# Altium project sig_gen_card.PrjPcb (part 4 of 4)
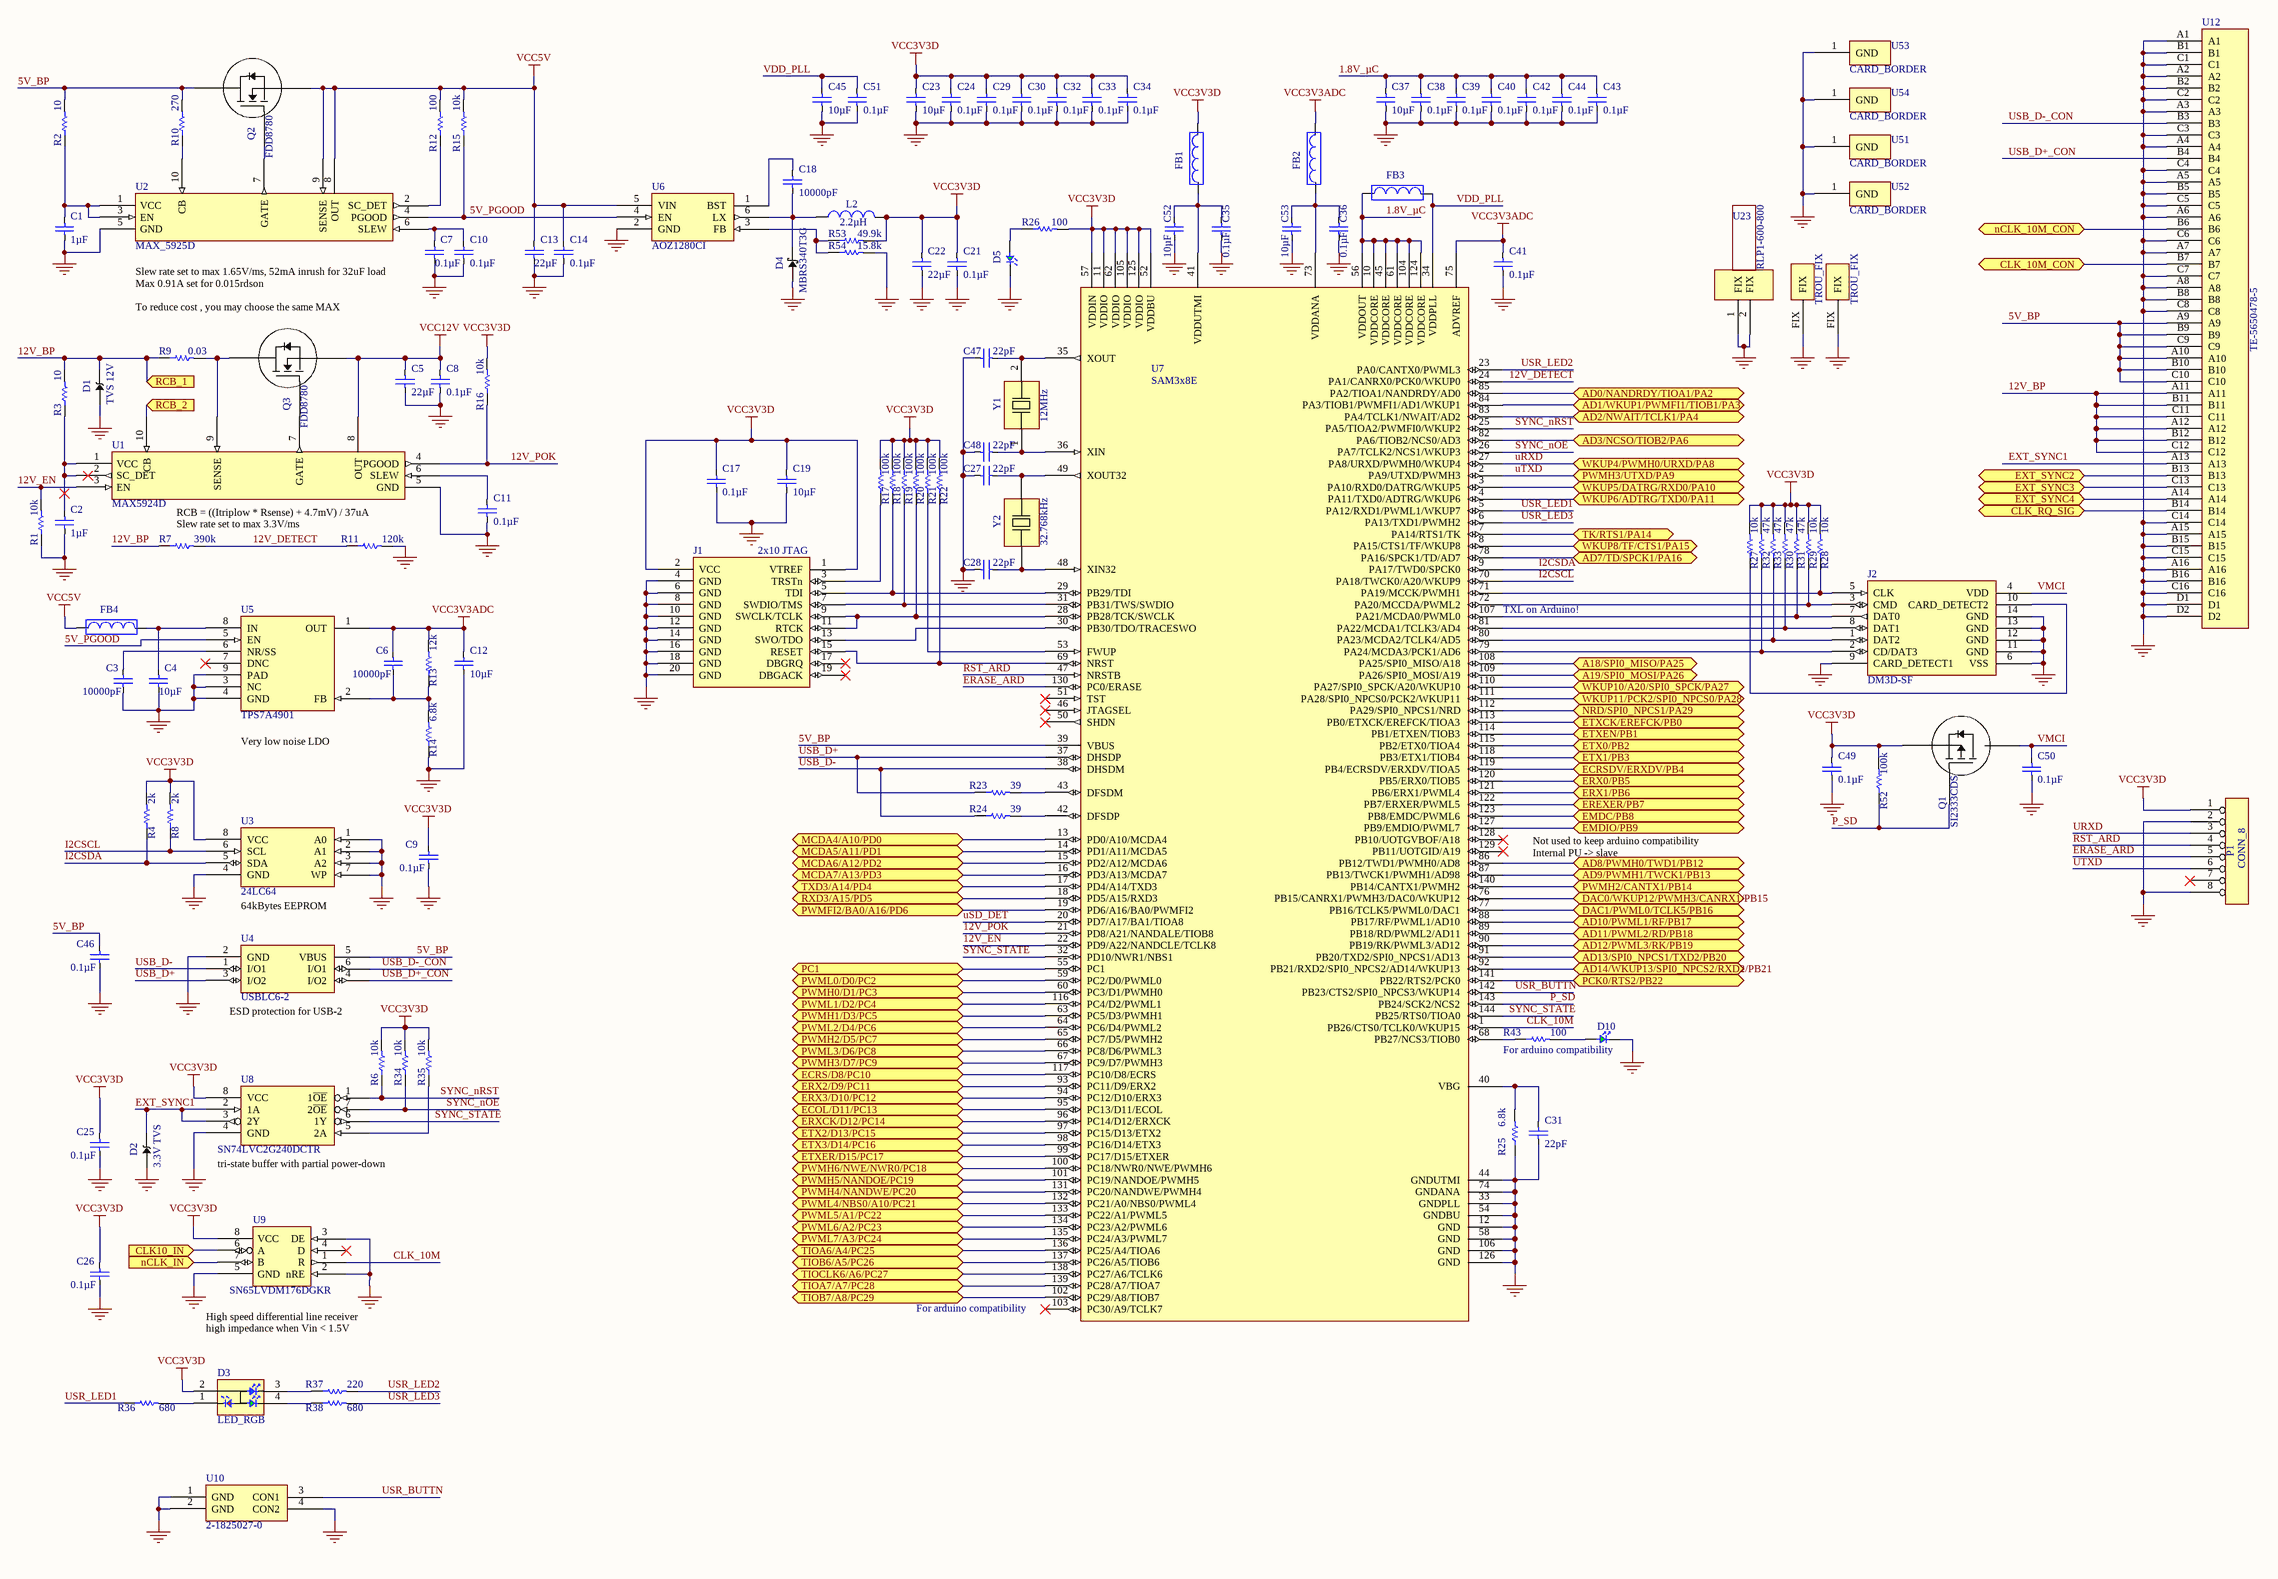
[diagram p7: EasyPHI_Core.SchDoc]

## Sheet EasyPHI_Core.SchDoc (continued)

### Library data of the parts (continued)
Y2 = ABS25-32.768KHZ-T: CRYSTAL 32.7680KHZ 12.5PF SMD; Manufacturer: Abracon LLC; Frequency Tolerance: ±20ppm; ESR (Equivalent Series Resistance): 50 kOhm; Operating Mode: Fundamental; Design Item Id: ABS25-32.768KHZ-T; Supplier 1: Digi-Key; Supplier Part Number 1: 535-9166-1-ND; Manufacturer Part Number: ABS25-32.768KHZ-T; RoHS: RoHS Compliant; Category: Crystals and Oscillators; Stock 1: 847492; Pricing 1: 1=0.38, 10=0.316, 50=0.2832, 100=0.252, 500=0.24, 1000=0.2016 (USD); Packaging: Cut Tape (CT); Type: kHz Crystal (Tuning Fork); Operating Temperature: -40°C ~ 85°C; Mounting Type: Surface Mount; Package / Case: 4-SOJ, 5.50mm pitch; ComponentLink1URL: http://www.abracon.com/Resonators/abs25.pdf; ComponentLink1Description: http://www.abracon.com/Resonators/abs25.pdf; Frequency Stability: -; Load Capacitance: 12.5pF; Ratings: -; Size / Dimension: 0.315" L x 0.150" W (8.00mm x 3.80mm); Height: 0.098" (2.50mm)

## Sheet Divider.SchDoc
size B; Organization: Mechanart, LLC; Address1: 397 Laurie Meadows Drive; Address2: Apt. 437; Address3: San Mateo, CA 94403
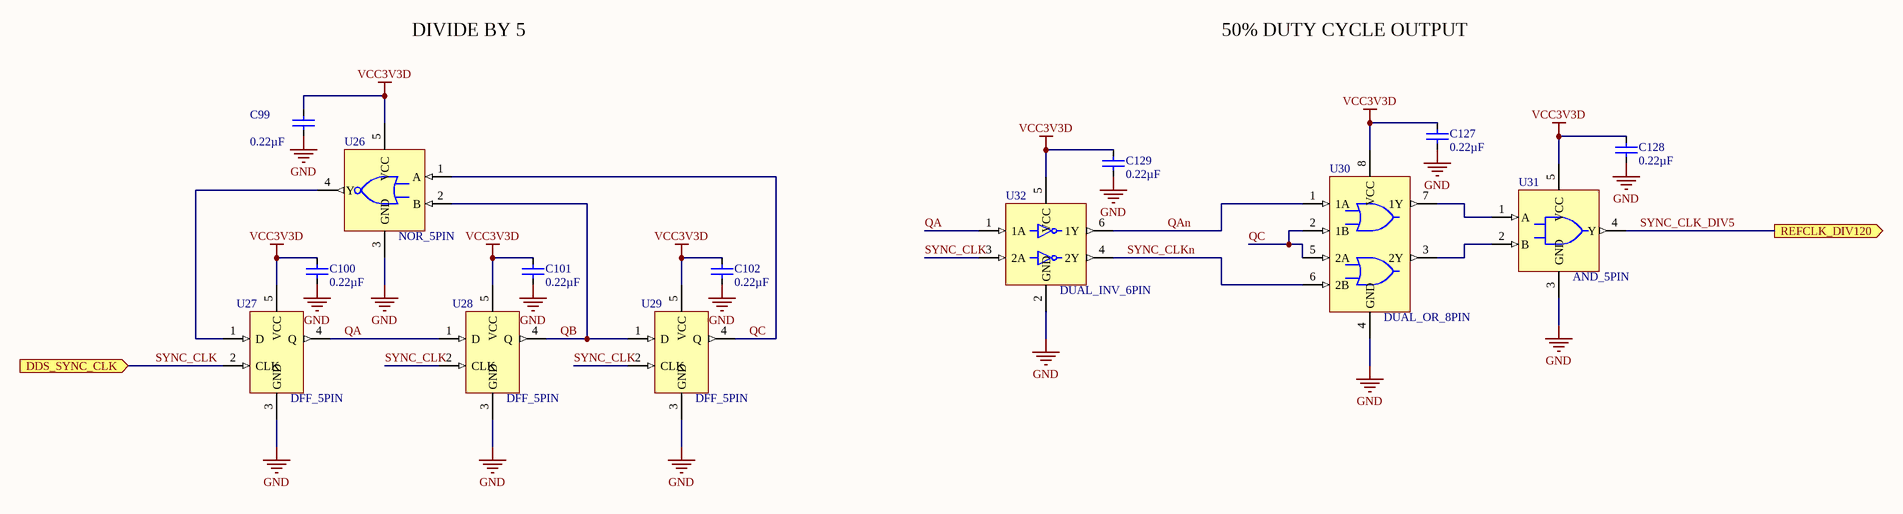
[diagram p5: Divider.SchDoc]

### Parts
(Parts that share a designator on the sheet are numbered #1, #2 ... from top to bottom, then left to right.)
C99#2  0.22µF  [CAPC1005X50L25N]
C100#2  0.22µF  [CAPC1005X50L25N]
C101#2  0.22µF  [CAPC1005X50L25N]
C102#2  0.22µF  [CAPC1005X50L25N]
C127  0.22µF  [CAPC1005X50L25N]
C128  0.22µF  [CAPC1005X50L25N]
C129  0.22µF  [CAPC1005X50L25N]
U26#2  NOR_5PIN  [SOT65P210X90-5L20N]
U27  DFF_5PIN  [SOT65P210X90-5L20N]
U28  DFF_5PIN  [SOT65P210X90-5L20N]
U29  DFF_5PIN  [SOT65P210X90-5L20N]
U30  DUAL_OR_8PIN  [SOP50P310X90-8L15N]
U31  AND_5PIN  [SOT65P210X90-5L20N]
U32  DUAL_INV_6PIN  [SOT65P210X110-6L20N]

### Ports
DDS_SYNC_CLK (in), REFCLK_DIV120 (out)

### Nets
GND: C99#2.2 C100#2.2 C101#2.2 C102#2.2 C127.2 C128.2 C129.2 U26#2.3(GND) U27.3(GND) U28.3(GND) U29.3(GND) U30.4(GND) U31.3(GND) U32.2(GND)
VCC3V3D: C99#2.1 C100#2.1 C101#2.1 C102#2.1 C127.1 C128.1 C129.1 U26#2.5(VCC) U27.5(VCC) U28.5(VCC) U29.5(VCC) U30.8(VCC) U31.5(VCC) U32.5(VCC)
QA: U27.4(Q) U28.1(D) U32.1(1A)
QAn: U30.1(1A) U32.6(1Y)
QB: U26#2.2(B) U28.4(Q) U29.1(D)
QC: U26#2.1(A) U29.4(Q) U30.2(1B) U30.5(2A)
SYNC_CLK: U27.2(CLK) U28.2(CLK) U29.2(CLK) U32.3(2A) ; port DDS_SYNC_CLK  [project net DDS_SYNC_CLK]
SYNC_CLK_DIV5: U31.4(Y) ; port REFCLK_DIV120  [project net REFCLK_DIV120]
SYNC_CLKn: U30.6(2B) U32.4(2Y)
NetU26#2_4: U26#2.4(Y) U27.1(D)
NetU30_3: U30.3(2Y) U31.2(B)
NetU30_7: U30.7(1Y) U31.1(A)

### Notes on the sheet
- DIVIDE BY 5
- 50% DUTY CYCLE OUTPUT
- Title
- Size:
- Date:
- B
- Number:
- Time:
- Revision:
- Sheet
- of
- File:

### Library data of the parts
C99#2 C100#2 C101#2 C102#2 C127-C129 = GRT155R6YA224KE01D: CAP CER 0.22UF 35V 10% X5R 0402; Manufacturer: Murata Electronics North America; Design Item Id: GRT155R6YA224KE01D; Supplier 1: Digi-Key; Supplier Part Number 1: 490-12271-1-ND; Manufacturer Part Number: GRT155R6YA224KE01D; RoHS: RoHS Compliant; Category: Capacitors; Stock 1: 8428; Pricing 1: 1=0.1, 10=0.054, 50=0.0292, 100=0.0248, 250=0.02024, 500=0.01732, 1000=0.0135, 5000=0.01125 (USD); Packaging: Cut Tape (CT); Applications: Automotive; Operating Temperature: -55°C ~ 85°C; Mounting Type: Surface Mount, MLCC; Package / Case: 0402 (1005 Metric); ComponentLink1URL: http://search.murata.co.jp/Ceramy/image/img/A01X/G101/ENG/GRT155R6YA224KE01-01.pdf; ComponentLink1Description: http://search.murata.co.jp/Ceramy/image/img/A01X/G101/ENG/GRT155R6YA224KE01-01.pdf; Capacitance: 0.22µF; Tolerance: ±10%; Voltage - Rated: 35V; Temperature Coefficient: X5R; Ratings: AEC-Q200; Size / Dimension: 0.039" L x 0.020" W (1.00mm x 0.50mm); Height - Seated (Max): -; Thickness (Max): 0.022" (0.55mm); Lead Spacing: -; Features: Derating Recommended; Lead Style: -
U26#2 = SN74AUP1T02DCKR: IC GATE NOR 1CH 2-INP SC-70-5; Manufacturer: Texas Instruments; Logic Type: NOR Gate; Current - Output High, Low: 4mA, 4mA; Max Propagation Delay @ V, Max CL: 4.4ns @ 3.3V, 30pF; Voltage - Supply: 2.3 V ~ 3.6 V; Number of Circuits: 1; Number of Inputs: 2; Current - Quiescent (Max): 0.5µA; Logic Level - Low: 0.35 V ~ 0.5 V; Logic Level - High: 1.1 V ~ 1.19 V; Design Item Id: SN74AUP1T02DCKR; Supplier 1: Digi-Key; Supplier Part Number 1: 296-27389-1-ND; Manufacturer Part Number: SN74AUP1T02DCKR; RoHS: RoHS Compliant; Category: Integrated Circuits (ICs); Stock 1: 6420; Pricing 1: 1=0.36, 10=0.29, 100=0.198, 500=0.1482, 1000=0.111 (USD); Packaging: Cut Tape (CT); Operating Temperature: -40°C ~ 85°C; Mounting Type: Surface Mount; Package / Case: 5-TSSOP, SC-70-5, SOT-353; Supplier Device Package: SC-70-5; ComponentLink1URL: http://www.ti.com/lit/ds/symlink/sn74aup1t02.pdf; ComponentLink1Description: http://www.ti.com/lit/ds/symlink/sn74aup1t02.pdf; Features: Schmitt Trigger
U27-U29 = SN74AUP1G79DCKR: IC D-TYPE POS TRG SNGL SC70-5; Manufacturer: Texas Instruments; Number of Elements: 1; Current - Output High, Low: 4mA, 4mA; Function: Standard; Output Type: Non-Inverted; Frequency - Clock: 266MHz; Max Propagation Delay @ V, Max CL: 5.8ns @ 3.3V, 30pF; Trigger Type: Positive Edge; Voltage - Supply: 0.8 V ~ 3.6 V; Current - Quiescent: 0.5µA; Input Capacitance: 1.5pF; Design Item Id: SN74AUP1G79DCKR; Supplier 1: Digi-Key; Supplier Part Number 1: 296-17660-1-ND; Manufacturer Part Number: SN74AUP1G79DCKR; RoHS: RoHS Compliant; Category: Integrated Circuits (ICs); Stock 1: 8359; Pricing 1: 1=0.48, 10=0.365, 100=0.2274, 500=0.15544, 1000=0.11948 (USD); Packaging: Cut Tape (CT); Operating Temperature: -40°C ~ 85°C (TA); Mounting Type: Surface Mount; Package / Case: 5-TSSOP, SC-70-5, SOT-353; ComponentLink1URL: http://www.ti.com/lit/ds/symlink/sn74aup1g79.pdf; ComponentLink1Description: http://www.ti.com/lit/ds/symlink/sn74aup1g79.pdf; Number of Bits per Element: 1; Type: D-Type
U30 = SN74AUP2G32DCUR: IC GATE OR 2CH 2-INP US8; Manufacturer: Texas Instruments; Logic Type: OR Gate; Current - Output High, Low: 4mA, 4mA; Max Propagation Delay @ V, Max CL: 6.2ns @ 3.3V, 30pF; Voltage - Supply: 0.8 V ~ 3.6 V; Number of Circuits: 2; Current - Quiescent (Max): 0.5µA; Logic Level - Low: 0.7 V ~ 0.9 V; Logic Level - High: 1.6 V ~ 2 V; Design Item Id: SN74AUP2G32DCUR; Supplier 1: Digi-Key; Supplier Part Number 1: 296-32275-1-ND; Manufacturer Part Number: SN74AUP2G32DCUR; RoHS: RoHS Compliant; Category: Integrated Circuits (ICs); Stock 1: 19917; Pricing 1: 1=0.62, 10=0.544, 100=0.416, 500=0.3296, 1000=0.264 (USD); Packaging: Cut Tape (CT); Operating Temperature: -40°C ~ 85°C; Mounting Type: Surface Mount; Package / Case: 8-VFSOP (0.091", 2.30mm Width); Supplier Device Package: US8; ComponentLink1URL: http://www.ti.com/lit/ds/symlink/sn74aup2g32.pdf; ComponentLink1Description: http://www.ti.com/lit/ds/symlink/sn74aup2g32.pdf; Number of Inputs: 2; Features: -
U31 = SN74AUP1T08DCKR: IC GATE AND 1CH 2-INP SC-70-5; Manufacturer: Texas Instruments; Logic Type: AND Gate; Current - Output High, Low: 4mA, 4mA; Max Propagation Delay @ V, Max CL: 4.4ns @ 3.3V, 30pF; Voltage - Supply: 2.3 V ~ 3.6 V; Number of Circuits: 1; Number of Inputs: 2; Current - Quiescent (Max): 0.5µA; Logic Level - Low: 0.35 V ~ 0.5 V; Logic Level - High: 1.1 V ~ 1.19 V; Design Item Id: SN74AUP1T08DCKR; Supplier 1: Digi-Key; Supplier Part Number 1: 296-27391-1-ND; Manufacturer Part Number: SN74AUP1T08DCKR; RoHS: RoHS Compliant; Category: Integrated Circuits (ICs); Stock 1: 3388; Pricing 1: 1=0.36, 10=0.29, 100=0.198, 500=0.1482, 1000=0.111 (USD); Packaging: Cut Tape (CT); Operating Temperature: -40°C ~ 85°C; Mounting Type: Surface Mount; Package / Case: 5-TSSOP, SC-70-5, SOT-353; Supplier Device Package: SC-70-5; ComponentLink1URL: http://www.ti.com/lit/ds/symlink/sn74aup1t08.pdf; ComponentLink1Description: http://www.ti.com/lit/ds/symlink/sn74aup1t08.pdf; Features: Schmitt Trigger
U32 = SN74AUP2G14DCKR: IC INVERT SCHMIT TRIG DL SC70-6; Manufacturer: Texas Instruments; Logic Type: Inverter; Current - Output High, Low: 4mA, 4mA; Max Propagation Delay @ V, Max CL: 6.2ns @ 3.3V, 30pF; Voltage - Supply: 0.8 V ~ 3.6 V; Number of Circuits: 2; Current - Quiescent (Max): 0.5µA; Logic Level - Low: 0.1 V ~ 0.88 V; Logic Level - High: 0.6 V ~ 2.29 V; Design Item Id: SN74AUP2G14DCKR; Supplier 1: Digi-Key; Supplier Part Number 1: 296-27361-1-ND; Manufacturer Part Number: SN74AUP2G14DCKR; RoHS: RoHS Compliant; Category: Integrated Circuits (ICs); Stock 1: 9021; Pricing 1: 1=0.45, 10=0.387, 100=0.289, 500=0.227, 1000=0.175 (USD); Packaging: Cut Tape (CT); Operating Temperature: -40°C ~ 85°C; Mounting Type: Surface Mount; Package / Case: 6-TSSOP, SC-88, SOT-363; Supplier Device Package: SC-70-6; ComponentLink1URL: http://www.ti.com/lit/ds/symlink/sn74aup2g14.pdf; ComponentLink1Description: http://www.ti.com/lit/ds/symlink/sn74aup2g14.pdf; Number of Inputs: 2; Features: Schmitt Trigger

## Nets that join several sheets
DDS1V8A: DDS (7 pins), Power (C122.1 R81.2 U26#1.9 U26#1.10)
DDS1V8D: DDS (7 pins), Power (R65.2 R66.2 R67.2 R73.2)
DDS3V3A: DDS (29 pins), Power (5 pins)
GND: Reconstruction_Filter (C75.2 C76.2 C77.2 T1.3), Power (50 pins), EasyPHI_Core (139 pins), Divider (14 pins)
IN: Power (52 pins), EasyPHI_Core (C5.1 C8.1 Q3.3 U1.8)
VCC3V3D: EasyPHI_Core (53 pins), Divider (14 pins)
VCO_VCC: DDS (C84.1 U14.14), Power (C120.1 R80.2 U25.9 U25.10)
12V_BP: DSG_Card_TopLevel (R5.1), EasyPHI_Core (10 pins)
DDS_D0: DDS (J4.1 U11.22), EasyPHI_Core (U7.111)
DDS_D1: DDS (J4.2 U11.21), EasyPHI_Core (U7.110)
DDS_D2: DDS (J4.3 U11.20), EasyPHI_Core (U7.109)
DDS_D3: DDS (J4.4 U11.19), EasyPHI_Core (U7.108)
DDS_OUT_N: DDS (U11.41), Reconstruction_Filter (C79.1)
DDS_OUT_P: DDS (U11.42), Reconstruction_Filter (C78.1)
DDS_SYNC_CLK: DDS (J3.11 U11.82), Divider (U27.2 U28.2 U29.2 U32.3)
NetL4_2: DSG_Card_TopLevel (OUT1.1), Reconstruction_Filter (L4.2 L7.2)
NetR5_2: DSG_Card_TopLevel (R5.2), EasyPHI_Core (U1.10)